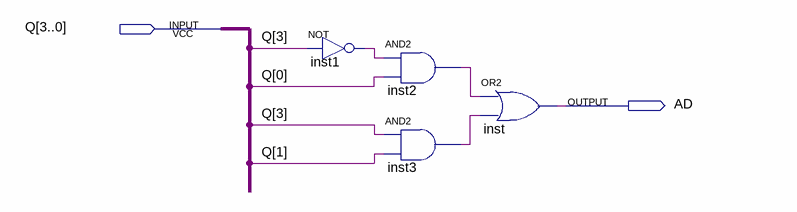
[diagram p0: schematic sheet]
// Quartus schematic AmarilloDerecha.bdf as structural Verilog: 4 symbols, 2 pins
module AmarilloDerecha (
  input  [3:0] Q,
  output AD
);

  wire inst1_out, inst2_out, inst3_out;

  not inst1 (inst1_out, Q[3]);
  and inst2 (inst2_out, inst1_out, Q[0]);
  and inst3 (inst3_out, Q[3], Q[1]);
  or inst (AD, inst2_out, inst3_out);
endmodule
